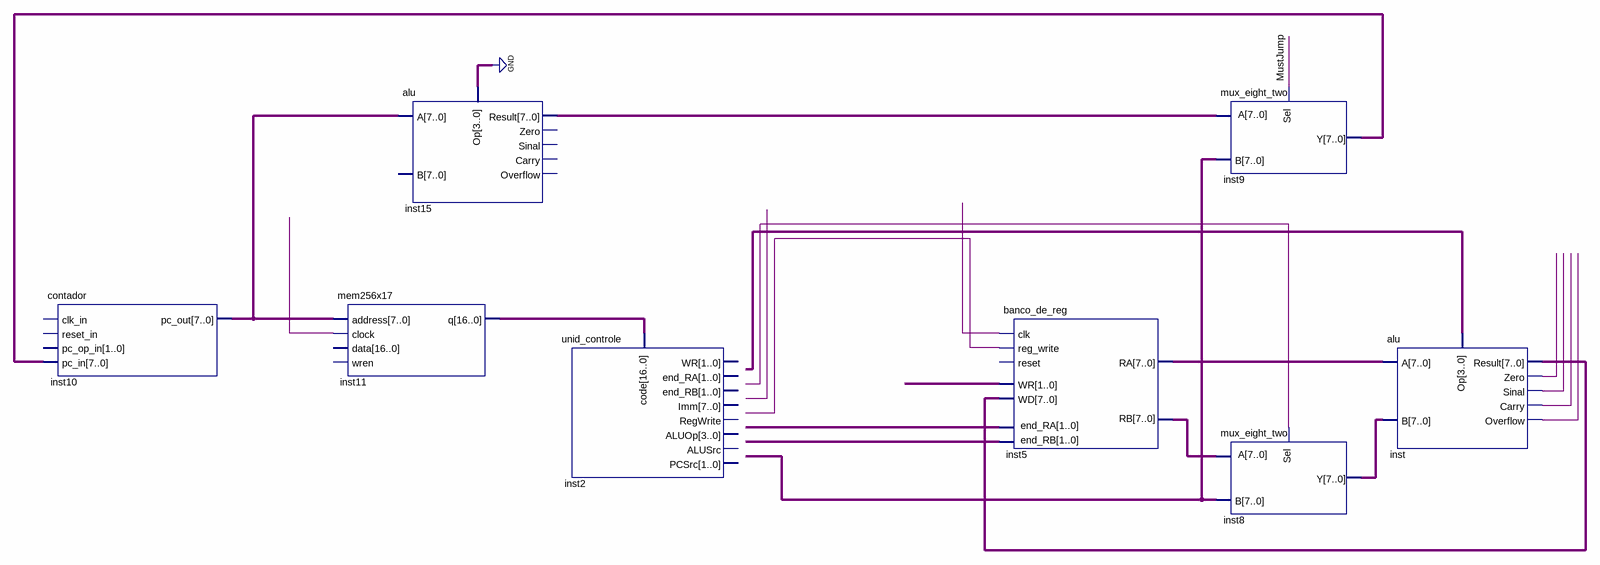
[diagram p0: schematic sheet]
// Quartus schematic cpu.bdf as structural Verilog: 8 symbols, 0 pins
module cpu (
);

  wire inst_carry, inst_overflow, inst_sinal, inst_zero, MustJump, undriven, undriven_2, undriven_6,
       undriven_7;
  wire [1:0] undriven_3, undriven_4, undriven_5;
  wire [3:0] undriven_8;
  wire [7:0] inst5_ra, inst5_rb, inst8_y, inst9_y, inst10_pc_out, inst15_result, inst_result, undriven_9;
  wire [16:0] inst11_q;

  contador inst10 (.pc_in(inst9_y), .pc_out(inst10_pc_out));  // open: clk_in, reset_in, pc_op_in
  mem256x17 inst11 (.address(inst10_pc_out), .clock(undriven_2), .q(inst11_q));  // open: data, wren
  alu inst15 (.A(inst10_pc_out), .Op(4'b0000), .Result(inst15_result));  // open: B, Zero, Sinal, Carry, Overflow
  unid_controle inst2 (.code(inst11_q));  // open: WR, end_RA, end_RB, Imm, RegWrite, ALUOp, ALUSrc, PCSrc
  banco_de_reg inst5 (
    .clk(undriven), .reg_write(undriven_6), .WR(undriven_3), .WD(inst_result), .end_RA(undriven_5),
    .end_RB(undriven_4), .RA(inst5_ra), .RB(inst5_rb));  // open: reset
  mux_eight_two inst9 (.A(inst15_result), .B(undriven_9), .Sel(MustJump), .Y(inst9_y));
  mux_eight_two inst8 (.A(inst5_rb), .B(undriven_9), .Sel(undriven_7), .Y(inst8_y));
  alu inst (
    .A(inst5_ra), .B(inst8_y), .Op(undriven_8), .Result(inst_result), .Zero(inst_zero), .Sinal(inst_sinal),
    .Carry(inst_carry), .Overflow(inst_overflow));
endmodule
